# EasyEDA Pro project FOC12.epro, schematic Schematic4
Board Name: I2C编码器板; Create Date: 2025-02-02; Page Name: P1; Project Name: FOC11; Schematic Name: Schematic4; Update Date: 2025-03-01; Company: 嘉立创EDA; Page Size: A4; Version: V1.0
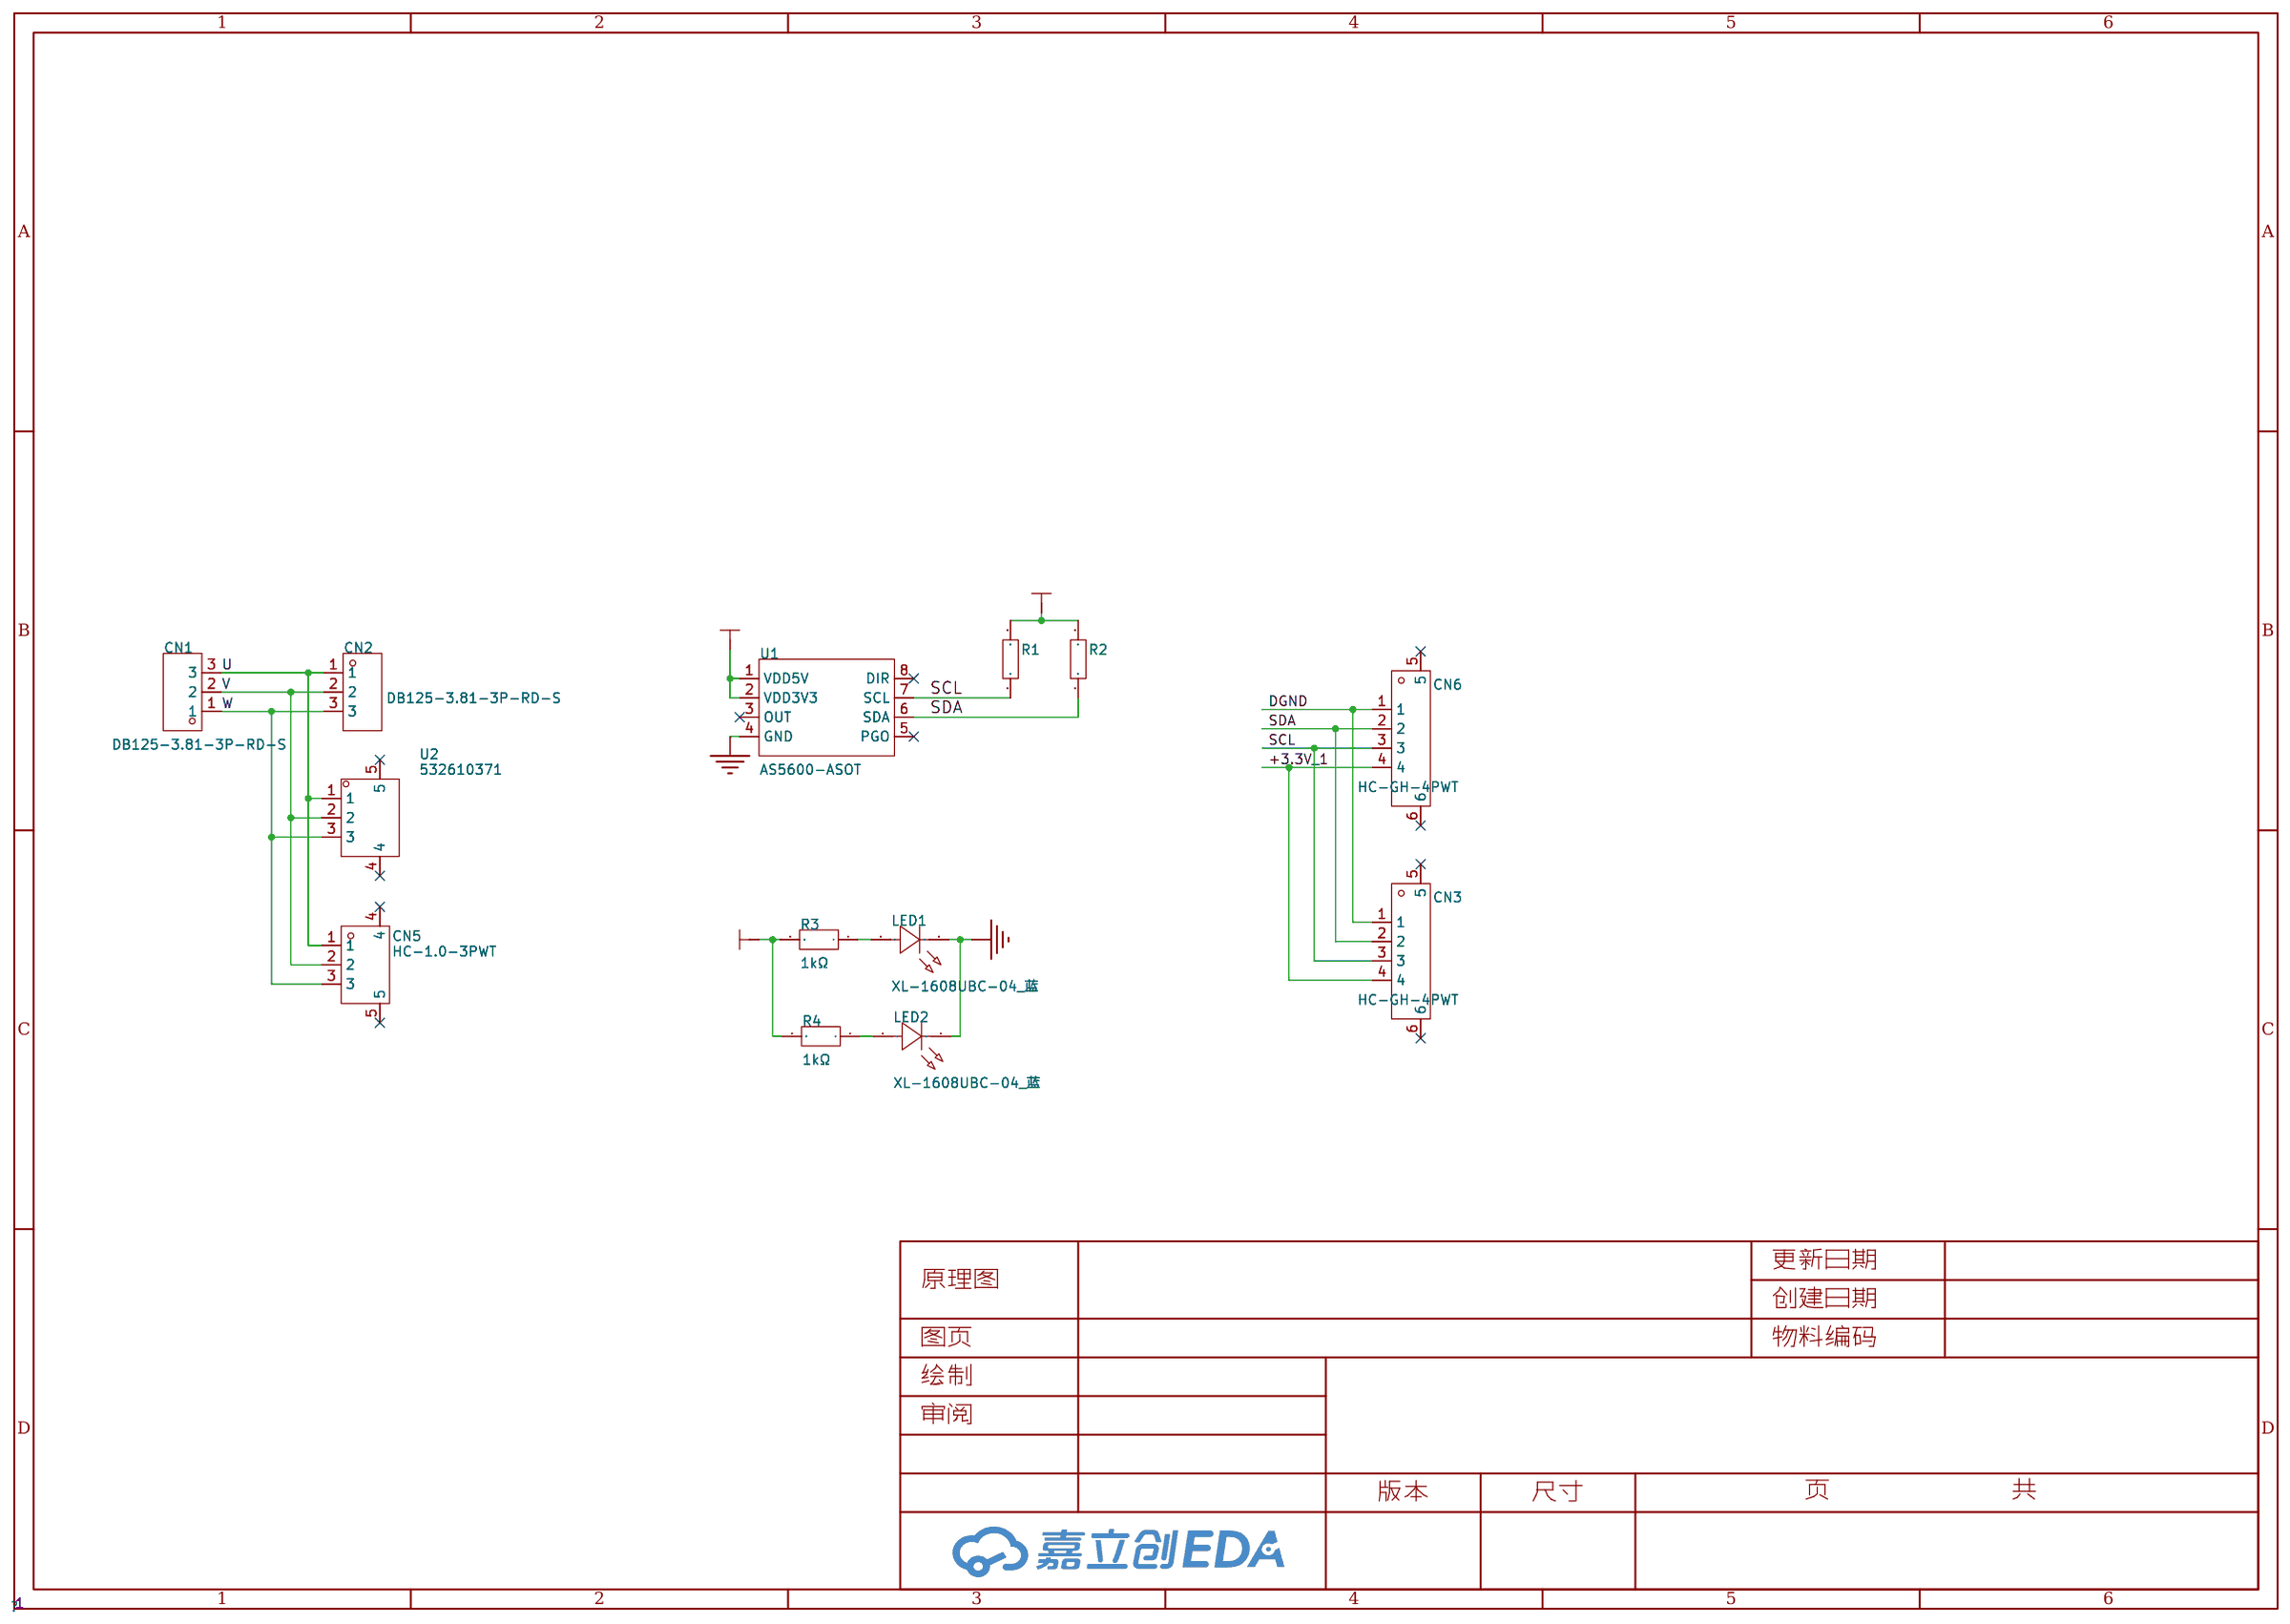
[diagram p3: schematic sheet]

## Parts
CN1  DB125-3.81-3P-RD-S  [CONN-TH_3P-P3.81_L7.4-W11.4]
CN2  DB125-3.81-3P-RD-S  [CONN-TH_3P-P3.81_L7.4-W11.4]
CN3  HC-GH-4PWT  [CONN-SMD_HC-GH-4PWT]
CN5  HC-1.0-3PWT  [CONN-SMD_3P-P1.0-HC-1.0-3PWT]
CN6  HC-GH-4PWT  [CONN-SMD_HC-GH-4PWT]
LED1  XL-1608UBC-04_蓝  [LED0603-RD_BLUE]
LED2  XL-1608UBC-04_蓝  [LED0603-RD_BLUE]
R1  10kΩ  [R0603]
R2  10kΩ  [R0603]
R3  1kΩ  [R0402]
R4  1kΩ  [R0402]
U1  AS5600-ASOT  [SOIC-8_L5.0-W4.0-P1.27-LS6.0-BL]
U2  532610371  [CONN-TH_532610371]

## Library data of the parts
CN1 CN2 = DB125-3.81-3P-RD-S: 间距:3.81mm;排数:1;每排PIN数:3;安装方式:直针;额定电流:10A;额定电压:300V;线规 - AWG:16~26;线规 - mm2:0.5~1;工作温度范围:-40℃~+105℃;颜色:红色;; LCSC Part Name: 3.81mm 排数:1 每排P数:3 直针; Supplier Part: C2858301; Manufacturer: DIBO(地博电气); Supplier Footprint: 插件,P=3.81mm; JLCPCB Part Class: Extended Part; Datasheet: https://atta.szlcsc.com/upload/public/pdf/source/20230106/C365471D0EEC4572E65A25F407971D80.pdf; Supplier: LCSC; Pitch: 3.81mm; Number of Rows: 1; Number of PINs Per Row: 3; Mounting Style: 直针; Current Rating (Max): 10A; Voltage Rating (Max): 300V; Wire Gauge - AWG: 16~26; Wire Gauge - mm2: 0.5~1; Operating Temperature Range: -40℃~+105℃; Color: 红色
CN3 CN6 = HC-GH-4PWT_C2845399: 插针结构:1x4P;间距:1.25mm;安装方式:卧贴;参考系列:GH;总PIN数:4P;排数:1;每排PIN数:4;行距:-;额定电流:1A;触头材质:磷青铜;触头镀层:锡;工作温度范围:-25℃~+85℃;; LCSC Part Name: 1x4P 间距:1.25mm 卧贴 系列:GH; Supplier Part: C2845399; Manufacturer: HCTL(华灿天禄); Supplier Footprint: SMD,P=1.25mm,卧贴; JLCPCB Part Class: 扩展库; Datasheet: https://atta.szlcsc.com/upload/public/pdf/source/20231019/68551EBC7AE35D3AC54804DC204EA813.pdf; Supplier: LCSC; Pins Structure: 1x4P; Pitch: 1.25mm; Mounting Style: 卧贴; Reference Series: GH; Number of Pins: 4P; Number of Rows: 1; Number of PINs Per Row: 4; Current Rating (Max): 1A; Contact Material: 磷青铜; Contact Plating: 锡; Operating Temperature Range: -25℃~+85℃; Rated Voltage (Max): 50V; Plastic Material: LCP; Flame Retardant Rating: UL94V-0; Supplementary Features: 辅助焊脚; Z-Height of the Board: 4.25mm; X-Length of Bottom Edge on Board (Spacing Line): 8.25mm
CN5 = HC-1.0-3PWT: LCSC Part Name: 3P 卧贴 间距P=1mm; Supplier Part: C2845362; Manufacturer: HCTL(华灿天禄); Supplier Footprint: SMD; Datasheet: https://atta.szlcsc.com/upload/public/pdf/source/20210728/C2845362_36DD836A4869B94FBCF024FACE943612.pdf; Supplier: LCSC
LED1 LED2 = XL-1608UBC-04: 发光颜色:蓝色;功率:80mW;正向电流:25mA;主波长:460nm~469nm;透镜颜色:无色透明透镜;色温:-;发光角度:120°;载带方式:正贴;工作温度:-30℃~+85℃;; Supplier Part: C965807; Manufacturer: XINGLIGHT(成兴光); Supplier Footprint: 0603; JLCPCB Part Class: 扩展库; Datasheet: https://atta.szlcsc.com/upload/public/pdf/source/20240218/F76B043D1CDACE9DB8357580572EF0D5.pdf; Supplier: LCSC; Emitted Color: 蓝色; Power Dissipation: 80mW; Forward Current: 25mA; Dominant Wavelength: 460nm~469nm; Peak Wavelength: 475nm; Lens Color: 无色透明透镜; Viewing Angle: 120°; Mounting Sytle: 正贴; Operating Temperature: -30℃~+85℃
R1 R2 = 0603WAF1002T5E: 电阻类型:厚膜电阻;阻值:10kΩ;精度:±1%;功率:100mW;温度系数:±100ppm/℃;最大工作电压:75V;工作温度范围:-55℃~+155℃;; LCSC Part Name: 10kΩ ±1% 100mW; Supplier Part: C25804; Manufacturer: UNI-ROYAL(厚声); Supplier Footprint: 0603; JLCPCB Part Class: Basic Part; Datasheet: https://atta.szlcsc.com/upload/public/pdf/source/20200306/C422600_1E6D84923E4A46A82E41ADD87F860B5C.pdf; Supplier: LCSC; Type: 厚膜电阻; Tolerance: ±1%; Power(Watts): 100mW; Overload Voltage (Max): 75V; Temperature Coefficient: ±100ppm/℃; Operating Temperature Range: -55℃~+155℃
R3 R4 = FRC0402J102 TS: 电阻类型:厚膜电阻;阻值:1kΩ;精度:±5%;功率:62.5mW;最大工作电压:50V;温度系数:±100ppm/℃;; LCSC Part Name: 1kΩ ±5% 62.5mW 厚膜电阻; Supplier Part: C2906899; Manufacturer: FOJAN(富捷); Supplier Footprint: 0402; JLCPCB Part Class: 扩展库; Datasheet: https://atta.szlcsc.com/upload/public/pdf/source/20211221/925EC7D7225764EE0046F22065062C87.pdf; Supplier: LCSC; Type: 厚膜电阻; Tolerance: ±5%; Power(Watts): 62.5mW; Overload Voltage (Max): 50V; Temperature Coefficient: ±100ppm/℃; Operating Temperature Range: -55℃~+155℃
U1 = AS5600-ASOT: Supplier Part: C499458; Manufacturer: ams(艾迈斯半导体); Supplier Footprint: SOIC-8; JLCPCB Part Class: Extended Part; Datasheet: https://atta.szlcsc.com/upload/public/pdf/source/20200324/C499458_E1461AFB0CE1042DE5756821C534625C.pdf; Supplier: LCSC
U2 = 532610371: 参考系列:-;间距:1.25mm;插针结构:1x3P;排数:1;每排PIN数:3;行距:-;安装方式:-;触头材质:青铜;; Supplier Part: C293630; Manufacturer: MOLEX; Supplier Footprint: SMD,P=1.25mm; JLCPCB Part Class: Extended Part; Datasheet: https://atta.szlcsc.com/upload/public/pdf/source/20181030/C293630_644FD371948C92BD51E6614399C64E30.pdf; Supplier: LCSC; Pins Structure: 1x3P; Pitch: 1.25mm; Number of Rows: 1; Number of PINs Per Row: 3; Contact Material: 青铜

## Nets
+3.3V_1: CN3.4 CN6.4 R1.2 R2.2 R3.2 R4.2 U1.1(VDD5V) U1.2(VDD3V3)
DGND: CN3.1 CN6.1 LED1.1(K) LED2.1(K) U1.4(GND)
SCL: CN3.3 CN6.3 R1.1 U1.7(SCL)
SDA: CN3.2 CN6.2 R2.1 U1.6(SDA)
U: CN1.3 CN2.1 CN5.1 U2.1
V: CN1.2 CN2.2 CN5.2 U2.2
W: CN1.1 CN2.3 CN5.3 U2.3
$1N581: LED1.2(A) R3.1
$1N584: LED2.2(A) R4.1

Not connected (* = marked no-connect by the designer): CN3 5* 6*; CN5 4* 5*; CN6 5* 6*; U1 3(OUT)* 5(PGO)* 8(DIR)*; U2 4* 5*
